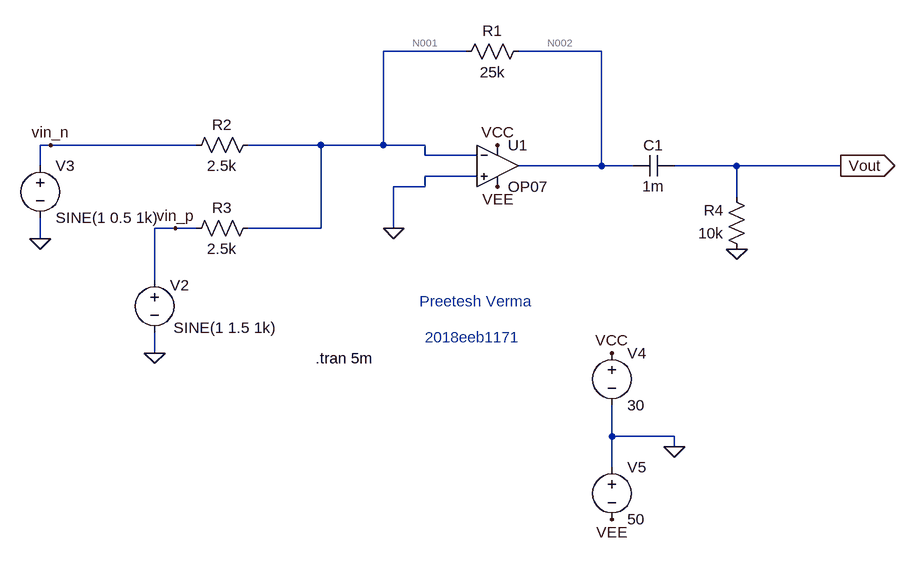
[diagram p0: schematic IdealOPamp_adder.asc]
IdealOPamp_adder.asc, the LTspice schematic file:
Version 4
SHEET 1 1188 680
WIRE 288 -144 160 -144
WIRE 496 -144 368 -144
WIRE -352 0 -368 0
WIRE -128 0 -352 0
WIRE 64 0 -48 0
WIRE 160 0 160 -144
WIRE 160 0 64 0
WIRE 224 0 160 0
WIRE 224 16 224 0
WIRE 304 16 224 16
WIRE -368 32 -368 0
WIRE 496 32 496 -144
WIRE 496 32 368 32
WIRE 544 32 496 32
WIRE 704 32 608 32
WIRE 864 32 704 32
WIRE 304 48 224 48
WIRE 224 64 224 48
WIRE 224 64 176 64
WIRE 704 80 704 32
WIRE -160 128 -192 128
WIRE -128 128 -160 128
WIRE 64 128 64 0
WIRE 64 128 -48 128
WIRE 176 128 176 64
WIRE -368 144 -368 112
WIRE -192 208 -192 128
WIRE -192 320 -192 288
WIRE 512 448 512 400
WIRE 608 448 512 448
WIRE 608 464 608 448
WIRE 512 496 512 448
FLAG 864 32 Vout
IOPIN 864 32 Out
FLAG 608 464 0
FLAG 512 320 VCC
FLAG 336 0 VCC
FLAG 512 576 VEE
FLAG 336 64 VEE
FLAG -368 144 0
FLAG -192 320 0
FLAG 176 128 0
FLAG 704 160 0
FLAG -352 0 vin_n
FLAG -160 128 vin_p
SYMBOL res 384 -160 R90
WINDOW 0 0 56 VBottom 2
WINDOW 3 32 56 VTop 2
SYMATTR InstName R1
SYMATTR Value 25k
SYMBOL res -32 -16 R90
WINDOW 0 0 56 VBottom 2
WINDOW 3 32 56 VTop 2
SYMATTR InstName R2
SYMATTR Value 2.5k
SYMBOL res -32 112 R90
WINDOW 0 0 56 VBottom 2
WINDOW 3 32 56 VTop 2
SYMATTR InstName R3
SYMATTR Value 2.5k
SYMBOL voltage -192 192 R0
WINDOW 0 24 24 Left 2
WINDOW 3 29 89 Left 2
WINDOW 123 0 0 Left 0
WINDOW 39 0 0 Left 0
SYMATTR InstName V2
SYMATTR Value SINE(1 1.5 1k)
SYMBOL voltage -368 16 R0
WINDOW 123 0 0 Left 0
WINDOW 39 0 0 Left 0
SYMATTR InstName V3
SYMATTR Value SINE(1 0.5 1k)
SYMBOL Opamps\\OP07 336 -32 R0
SYMATTR InstName U1
SYMBOL voltage 512 304 R0
WINDOW 123 0 0 Left 0
WINDOW 39 0 0 Left 0
SYMATTR InstName V4
SYMATTR Value 30
SYMBOL voltage 512 480 R0
WINDOW 123 0 0 Left 0
WINDOW 39 0 0 Left 0
SYMATTR InstName V5
SYMATTR Value 50
SYMBOL res 720 176 R180
WINDOW 0 36 76 Left 2
WINDOW 3 36 40 Left 2
SYMATTR InstName R4
SYMATTR Value 10k
SYMBOL cap 608 16 R90
WINDOW 0 0 32 VBottom 2
WINDOW 3 32 32 VTop 2
SYMATTR InstName C1
SYMATTR Value 1m
TEXT 56 328 Left 2 !.tran 5m
TEXT 216 240 Left 2 ;Preetesh Verma
TEXT 224 296 Left 2 ;2018eeb1171

The netlist it stands for:
* IdealOPamp_adder.asc
R1 N002 N001 25k
R2 N001 vin_n 2.5k
R3 N001 vin_p 2.5k
V2 vin_p 0 SINE(1 1.5 1k)
V3 vin_n 0 SINE(1 0.5 1k)
XU1 0 N001 VCC VEE N002 LT1001  ; OP07, pins In+ In- V+ V- OUT
V4 VCC 0 30
V5 0 VEE 50
R4 0 Vout 10k
C1 Vout N002 1m
.tran 5m
* Preetesh Verma
* 2018eeb1171
.lib LTC.lib
.backanno
.end

* Results of the author's LTspice run, read from the files saved beside the schematic
* Operating Point, zero values left out:
*   V(n002) = -20 V
*   V(n001) = 13.5 µV
*   V(vin_n) = 1 V
*   V(vin_p) = 1 V
*   V(vcc) = 30 V
*   V(vee) = -50 V
*   I(R3) = -400 µA
*   I(R2) = -400 µA
*   I(R1) = -800 µA
*   I(V5) = -2.668 mA
*   I(V4) = -1.868 mA
*   I(V3) = -400 µA
*   I(V2) = -400 µA
*   Ix(u1:1) = 17.67 pA
*   Ix(u1:2) = 18.04 pA
*   Ix(u1:3) = 1.868 mA
*   Ix(u1:4) = -2.668 mA
*   Ix(u1:5) = 800 µA
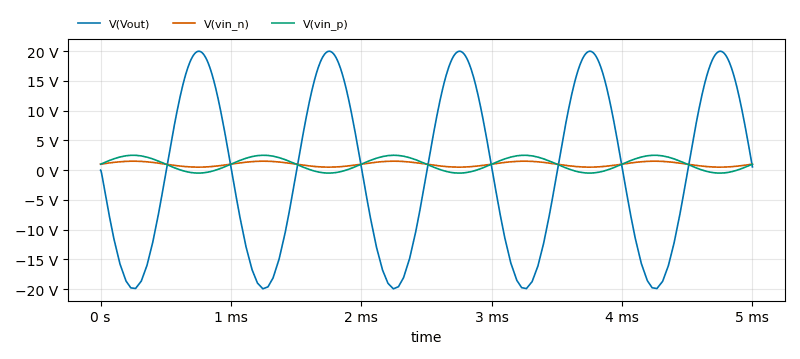
[diagram p1: Transient Analysis of IdealOPamp_adder.asc, plotted from the saved traces]
* Transient Analysis, 1 run:
*   V(Vout): min -19.96 V, max 19.99 V, average 35.37 mV, rms 14.12 V, last 544.2 mV
*   V(vin_n): min 500 mV, max 1.5 V, average 999.1 mV, rms 1.06 V, last 1 V
*   V(vin_p): min -500 mV, max 2.5 V, average 997.3 mV, rms 1.455 V, last 1 V